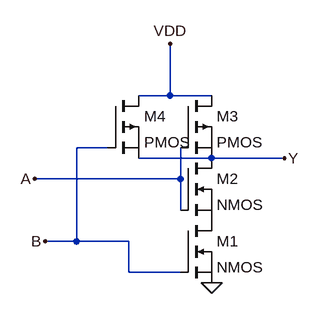
[diagram p0: schematic NAND.asc]
NAND.asc, the LTspice schematic file:
Version 4
SHEET 1 880 680
WIRE 64 -48 64 -128
WIRE 64 -48 16 -48
WIRE 128 -48 64 -48
WIRE -32 32 -80 32
WIRE 128 48 16 48
WIRE 240 48 128 48
WIRE 80 80 80 32
WIRE 80 80 -144 80
WIRE 80 128 80 80
WIRE -80 176 -80 32
WIRE -80 176 -128 176
WIRE 0 176 -80 176
WIRE 0 224 0 176
WIRE 80 224 0 224
WIRE 0 0 0 0
FLAG 128 240 0
FLAG 64 -128 VDD
FLAG 240 48 Y
FLAG -144 80 A
FLAG -128 176 B
SYMBOL nmos 80 144 R0
SYMATTR InstName M1
SYMBOL nmos 80 48 R0
SYMATTR InstName M2
SYMBOL pmos 80 -48 R0
SYMATTR InstName M3
SYMBOL pmos -32 -48 R0
SYMATTR InstName M4

The netlist it stands for:
* NAND.asc
M1 P001 B 0 0 NMOS
M2 Y A P001 P001 NMOS
M3 VDD A Y Y PMOS
M4 VDD B Y Y PMOS
.model NMOS NMOS
.model PMOS PMOS
.lib standard.mos
.backanno
.end